# Altium schematic sheet 1.1.0_Interface_board.SchDoc
size A4; DocumentNumber: 2; SheetNumber: 2; SheetTotal: 14
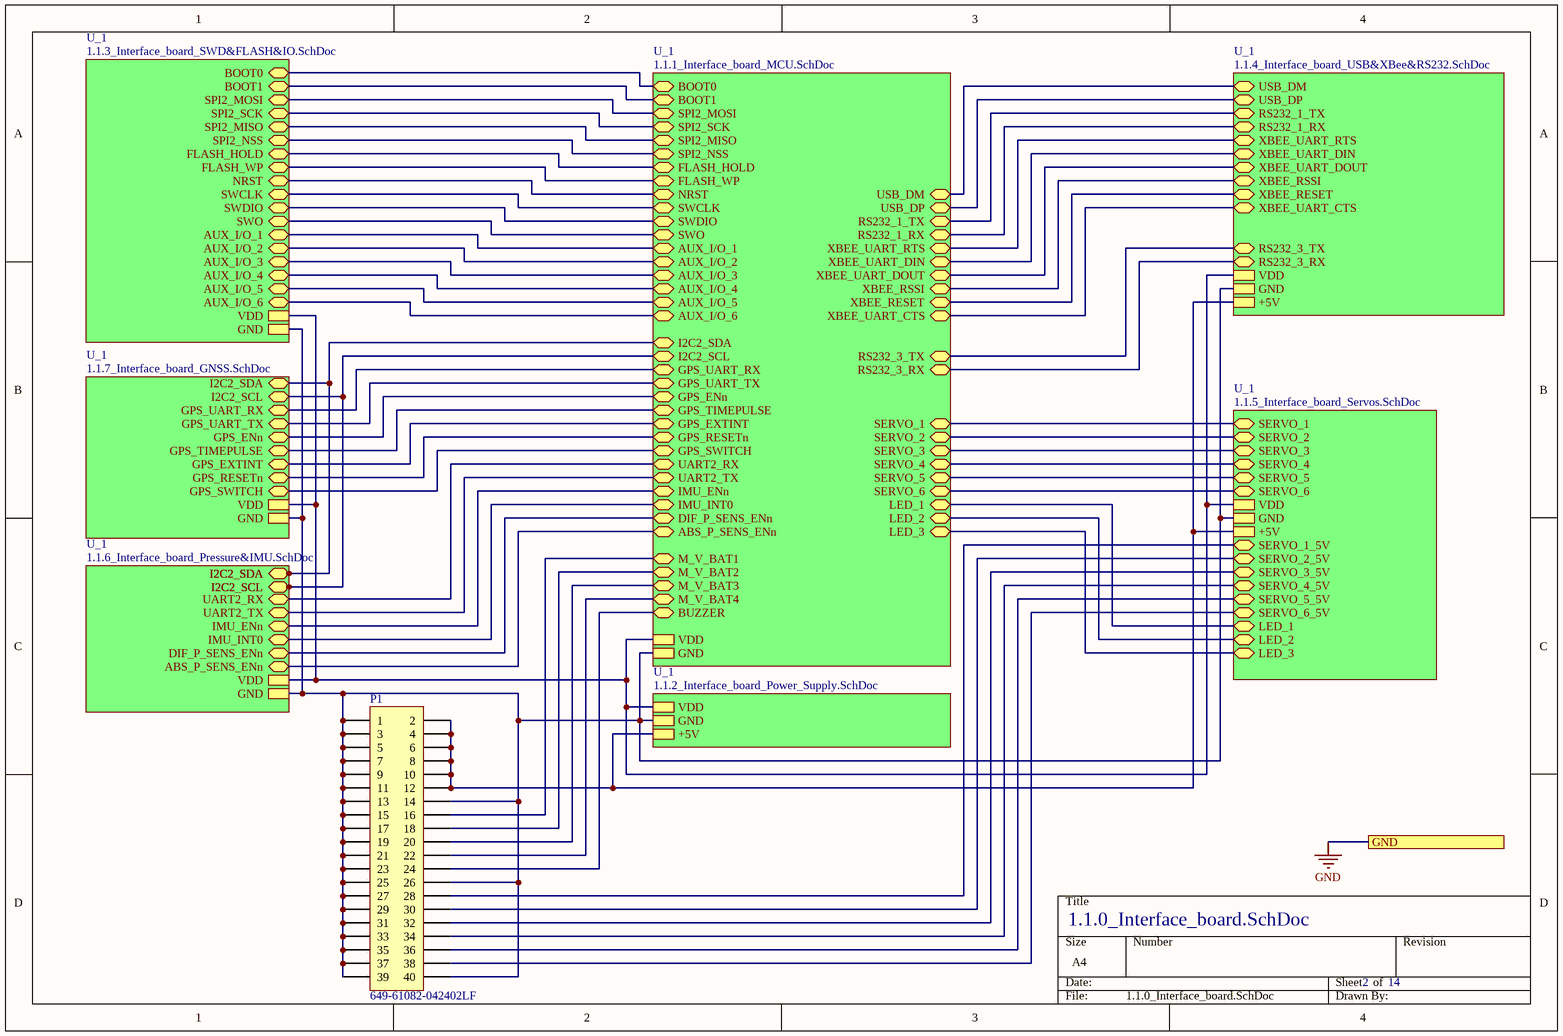
[diagram p0: 1.1.0_Interface_board.SchDoc]

## Parts
P1  Supplier Part Number 1: 649-61082-042402LF  [61082-042402LF]  (hidden comment: 61082-042402LF)

## Sub-sheets
U_1 = 1.1.1_Interface_board_MCU.SchDoc: USB_DM (bidir), USB_DP (bidir), SWO (bidir), SWCLK (bidir), SWDIO (bidir), BOOT0 (bidir), NRST (bidir), BOOT1 (bidir), I2C2_SCL (bidir), I2C2_SDA (bidir), RS232_1_TX (bidir), RS232_1_RX (bidir), SPI2_MOSI (bidir), SPI2_SCK (bidir), SPI2_MISO (bidir), SPI2_NSS (bidir), FLASH_WP (bidir), FLASH_HOLD (bidir), M_V_BAT2 (bidir), GPS_SWITCH (bidir), GPS_RESETn (bidir), M_V_BAT1 (bidir), ABS_P_SENS_ENn (bidir), DIF_P_SENS_ENn (bidir), SERVO_1 (bidir), SERVO_2 (bidir), SERVO_3 (bidir), SERVO_4 (bidir), SERVO_5 (bidir), SERVO_6 (bidir), GPS_UART_RX (bidir), GPS_UART_TX (bidir), UART2_TX (bidir), UART2_RX (bidir), RS232_3_TX (bidir), RS232_3_RX (bidir), XBEE_UART_RTS (bidir), XBEE_UART_CTS (bidir), XBEE_RESET (bidir), XBEE_UART_DIN (bidir), XBEE_UART_DOUT (bidir), M_V_BAT3 (bidir), AUX_I/O_2 (bidir), AUX_I/O_1 (bidir), AUX_I/O_3 (bidir), AUX_I/O_4 (bidir), BUZZER (bidir), AUX_I/O_5 (bidir), AUX_I/O_6 (bidir), XBEE_RSSI (bidir), VDD, GND, M_V_BAT4 (bidir), GPS_TIMEPULSE (bidir), GPS_ENn (bidir), GPS_EXTINT (bidir), IMU_INT0 (bidir), LED_1 (bidir), LED_2 (bidir), LED_3 (bidir), IMU_ENn (bidir)
U_1 = 1.1.2_Interface_board_Power_Supply.SchDoc: VDD, GND, +5V
U_1 = 1.1.3_Interface_board_SWD&FLASH&IO.SchDoc: BOOT0 (bidir), BOOT1 (bidir), SPI2_MOSI (bidir), SPI2_SCK (bidir), SPI2_MISO (bidir), SPI2_NSS (bidir), FLASH_HOLD (bidir), FLASH_WP (bidir), NRST (bidir), SWCLK (bidir), SWDIO (bidir), SWO (bidir), AUX_I/O_2 (bidir), AUX_I/O_1 (bidir), AUX_I/O_3 (bidir), AUX_I/O_4 (bidir), AUX_I/O_5 (bidir), AUX_I/O_6 (bidir), VDD, GND
U_1 = 1.1.4_Interface_board_USB&XBee&RS232.SchDoc: USB_DM (bidir), USB_DP (bidir), RS232_1_TX (bidir), RS232_1_RX (bidir), XBEE_UART_RTS (bidir), XBEE_UART_DIN (bidir), XBEE_UART_DOUT (bidir), XBEE_RSSI (bidir), XBEE_RESET (bidir), RS232_3_TX (bidir), RS232_3_RX (bidir), XBEE_UART_CTS (bidir), VDD, GND, +5V
U_1 = 1.1.5_Interface_board_Servos.SchDoc: SERVO_1 (bidir), SERVO_2 (bidir), SERVO_3 (bidir), SERVO_4 (bidir), SERVO_5 (bidir), SERVO_6 (bidir), VDD, GND, +5V, SERVO_1_5V (bidir), SERVO_2_5V (bidir), SERVO_3_5V (bidir), SERVO_4_5V (bidir), SERVO_5_5V (bidir), SERVO_6_5V (bidir), LED_1 (bidir), LED_2 (bidir), LED_3 (bidir)
U_1 = 1.1.6_Interface_board_Pressure&IMU.SchDoc: I2C2_SCL (bidir), I2C2_SDA (bidir), ABS_P_SENS_ENn (bidir), DIF_P_SENS_ENn (bidir), VDD, GND, UART2_TX (bidir), UART2_RX (bidir), IMU_INT0 (bidir), IMU_ENn (bidir), I2C2_SCL (bidir), I2C2_SDA (bidir), I2C2_SCL (bidir), I2C2_SDA (bidir)
U_1 = 1.1.7_Interface_board_GNSS.SchDoc: I2C2_SCL (bidir), I2C2_SDA (bidir), GPS_UART_RX (bidir), GPS_UART_TX (bidir), GPS_SWITCH (bidir), GPS_RESETn (bidir), GPS_EXTINT (bidir), GPS_ENn (bidir), GPS_TIMEPULSE (bidir), VDD, GND

## Ports
GND

## Nets
GND: port GND
NetP1_1: P1.1 P1.3 P1.5 P1.7 P1.9 P1.11 P1.13 P1.14 P1.15 P1.17 P1.19 P1.21 P1.23 P1.25 P1.26 P1.27 P1.29 P1.31 P1.33 P1.35 P1.37 P1.39 P1.40 ; sheet U_1/GND, sheet U_1/GND, sheet U_1/GND, sheet U_1/GND, sheet U_1/GND, sheet U_1/GND, sheet U_1/GND
NetP1_2: P1.2 P1.4 P1.6 P1.8 P1.10 P1.12 ; sheet U_1/+5V, sheet U_1/+5V, sheet U_1/+5V
NetP1_16: P1.16 ; sheet U_1/M_V_BAT1
NetP1_18: P1.18 ; sheet U_1/M_V_BAT2
NetP1_20: P1.20 ; sheet U_1/M_V_BAT3
NetP1_22: P1.22 ; sheet U_1/M_V_BAT4
NetP1_24: P1.24 ; sheet U_1/BUZZER
NetP1_28: P1.28 ; sheet U_1/SERVO_1_5V
NetP1_30: P1.30 ; sheet U_1/SERVO_2_5V
NetP1_32: P1.32 ; sheet U_1/SERVO_3_5V
NetP1_34: P1.34 ; sheet U_1/SERVO_4_5V
NetP1_36: P1.36 ; sheet U_1/SERVO_5_5V
NetP1_38: P1.38 ; sheet U_1/SERVO_6_5V
(unnamed): sheet U_1/USB_DM, sheet U_1/USB_DM
(unnamed): sheet U_1/USB_DP, sheet U_1/USB_DP
(unnamed): sheet U_1/SWO, sheet U_1/SWO
(unnamed): sheet U_1/SWCLK, sheet U_1/SWCLK
(unnamed): sheet U_1/SWDIO, sheet U_1/SWDIO
(unnamed): sheet U_1/BOOT0, sheet U_1/BOOT0
(unnamed): sheet U_1/NRST, sheet U_1/NRST
(unnamed): sheet U_1/BOOT1, sheet U_1/BOOT1
(unnamed): sheet U_1/I2C2_SCL, sheet U_1/I2C2_SCL, sheet U_1/I2C2_SCL, sheet U_1/I2C2_SCL, sheet U_1/I2C2_SCL
(unnamed): sheet U_1/I2C2_SDA, sheet U_1/I2C2_SDA, sheet U_1/I2C2_SDA, sheet U_1/I2C2_SDA, sheet U_1/I2C2_SDA
(unnamed): sheet U_1/RS232_1_TX, sheet U_1/RS232_1_TX
(unnamed): sheet U_1/RS232_1_RX, sheet U_1/RS232_1_RX
(unnamed): sheet U_1/SPI2_MOSI, sheet U_1/SPI2_MOSI
(unnamed): sheet U_1/SPI2_SCK, sheet U_1/SPI2_SCK
(unnamed): sheet U_1/SPI2_MISO, sheet U_1/SPI2_MISO
(unnamed): sheet U_1/SPI2_NSS, sheet U_1/SPI2_NSS
(unnamed): sheet U_1/FLASH_WP, sheet U_1/FLASH_WP
(unnamed): sheet U_1/FLASH_HOLD, sheet U_1/FLASH_HOLD
(unnamed): sheet U_1/GPS_SWITCH, sheet U_1/GPS_SWITCH
(unnamed): sheet U_1/GPS_RESETn, sheet U_1/GPS_RESETn
(unnamed): sheet U_1/ABS_P_SENS_ENn, sheet U_1/ABS_P_SENS_ENn
(unnamed): sheet U_1/DIF_P_SENS_ENn, sheet U_1/DIF_P_SENS_ENn
(unnamed): sheet U_1/SERVO_1, sheet U_1/SERVO_1
(unnamed): sheet U_1/SERVO_2, sheet U_1/SERVO_2
(unnamed): sheet U_1/SERVO_3, sheet U_1/SERVO_3
(unnamed): sheet U_1/SERVO_4, sheet U_1/SERVO_4
(unnamed): sheet U_1/SERVO_5, sheet U_1/SERVO_5
(unnamed): sheet U_1/SERVO_6, sheet U_1/SERVO_6
(unnamed): sheet U_1/GPS_UART_RX, sheet U_1/GPS_UART_RX
(unnamed): sheet U_1/GPS_UART_TX, sheet U_1/GPS_UART_TX
(unnamed): sheet U_1/UART2_TX, sheet U_1/UART2_TX
(unnamed): sheet U_1/UART2_RX, sheet U_1/UART2_RX
(unnamed): sheet U_1/RS232_3_TX, sheet U_1/RS232_3_TX
(unnamed): sheet U_1/RS232_3_RX, sheet U_1/RS232_3_RX
(unnamed): sheet U_1/XBEE_UART_RTS, sheet U_1/XBEE_UART_RTS
(unnamed): sheet U_1/XBEE_UART_CTS, sheet U_1/XBEE_UART_CTS
(unnamed): sheet U_1/XBEE_RESET, sheet U_1/XBEE_RESET
(unnamed): sheet U_1/XBEE_UART_DIN, sheet U_1/XBEE_UART_DIN
(unnamed): sheet U_1/XBEE_UART_DOUT, sheet U_1/XBEE_UART_DOUT
(unnamed): sheet U_1/AUX_I/O_2, sheet U_1/AUX_I/O_2
(unnamed): sheet U_1/AUX_I/O_1, sheet U_1/AUX_I/O_1
(unnamed): sheet U_1/AUX_I/O_3, sheet U_1/AUX_I/O_3
(unnamed): sheet U_1/AUX_I/O_4, sheet U_1/AUX_I/O_4
(unnamed): sheet U_1/AUX_I/O_5, sheet U_1/AUX_I/O_5
(unnamed): sheet U_1/AUX_I/O_6, sheet U_1/AUX_I/O_6
(unnamed): sheet U_1/XBEE_RSSI, sheet U_1/XBEE_RSSI
(unnamed): sheet U_1/VDD, sheet U_1/VDD, sheet U_1/VDD, sheet U_1/VDD, sheet U_1/VDD, sheet U_1/VDD, sheet U_1/VDD
(unnamed): sheet U_1/GPS_TIMEPULSE, sheet U_1/GPS_TIMEPULSE
(unnamed): sheet U_1/GPS_ENn, sheet U_1/GPS_ENn
(unnamed): sheet U_1/GPS_EXTINT, sheet U_1/GPS_EXTINT
(unnamed): sheet U_1/IMU_INT0, sheet U_1/IMU_INT0
(unnamed): sheet U_1/LED_1, sheet U_1/LED_1
(unnamed): sheet U_1/LED_2, sheet U_1/LED_2
(unnamed): sheet U_1/LED_3, sheet U_1/LED_3
(unnamed): sheet U_1/IMU_ENn, sheet U_1/IMU_ENn

## Library data of the parts
P1 = 61082-042402LF: Connecteurs carte à carte et mezzanine 40P RECPT; Supplier 1: Mouser